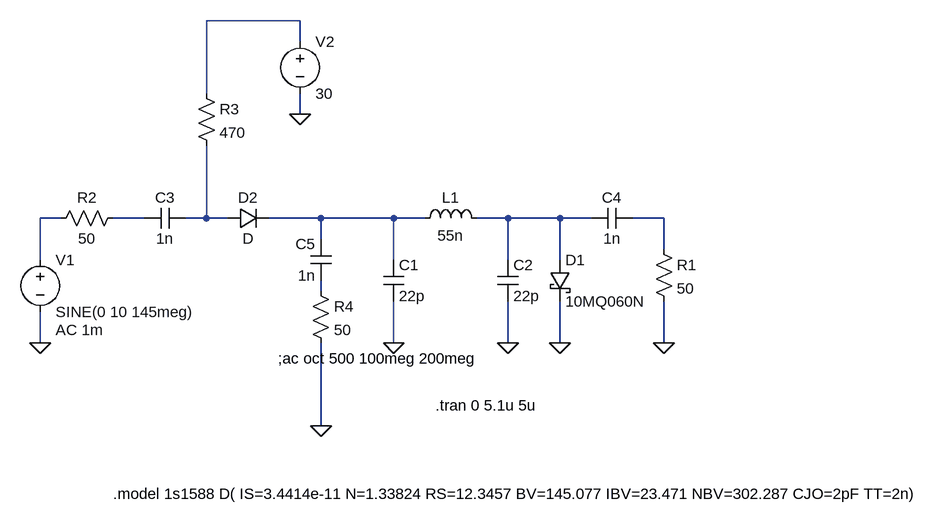
[diagram p0: schematic ANT SW.asc]
ANT SW.asc, the LTspice schematic file:
Version 4
SHEET 1 1196 680
WIRE 48 -224 -96 -224
WIRE 48 -192 48 -224
WIRE -96 -112 -96 -224
WIRE 48 -80 48 -112
WIRE -320 80 -352 80
WIRE -192 80 -240 80
WIRE -96 80 -96 -32
WIRE -96 80 -128 80
WIRE -64 80 -96 80
WIRE 80 80 0 80
WIRE 192 80 80 80
WIRE 240 80 192 80
WIRE 368 80 320 80
WIRE 448 80 368 80
WIRE 496 80 448 80
WIRE 608 80 560 80
WIRE 80 112 80 80
WIRE 608 128 608 80
WIRE -352 144 -352 80
WIRE 192 144 192 80
WIRE 368 144 368 80
WIRE 448 144 448 80
WIRE 80 192 80 176
WIRE -352 272 -352 224
WIRE 192 272 192 208
WIRE 368 272 368 208
WIRE 448 272 448 208
WIRE 608 272 608 208
WIRE 80 400 80 272
FLAG -352 272 0
FLAG 192 272 0
FLAG 368 272 0
FLAG 448 272 0
FLAG 608 272 0
FLAG 48 -80 0
FLAG 80 400 0
SYMBOL voltage -352 128 R0
WINDOW 123 24 124 Left 2
WINDOW 39 0 0 Left 2
SYMATTR InstName V1
SYMATTR Value SINE(0 10 145meg)
SYMATTR Value2 AC 1m
SYMBOL cap 176 144 R0
SYMATTR InstName C1
SYMATTR Value 22p
SYMBOL cap 352 144 R0
SYMATTR InstName C2
SYMATTR Value 22p
SYMBOL schottky 432 144 R0
SYMATTR InstName D1
SYMATTR Value 10MQ060N
SYMATTR Description Diode
SYMATTR Type diode
SYMBOL res 592 112 R0
SYMATTR InstName R1
SYMATTR Value 50
SYMBOL res -224 64 R90
WINDOW 0 0 56 VBottom 2
WINDOW 3 32 56 VTop 2
SYMATTR InstName R2
SYMATTR Value 50
SYMBOL ind 224 96 R270
WINDOW 0 32 56 VTop 2
WINDOW 3 5 56 VBottom 2
SYMATTR InstName L1
SYMATTR Value 55n
SYMBOL cap -128 64 R90
WINDOW 0 0 32 VBottom 2
WINDOW 3 32 32 VTop 2
SYMATTR InstName C3
SYMATTR Value 1n
SYMBOL voltage 48 -208 R0
WINDOW 123 0 0 Left 2
WINDOW 39 0 0 Left 2
SYMATTR InstName V2
SYMATTR Value 30
SYMBOL res -112 -128 R0
SYMATTR InstName R3
SYMATTR Value 470
SYMBOL res 64 176 R0
SYMATTR InstName R4
SYMATTR Value 50
SYMBOL cap 560 64 R90
WINDOW 0 0 32 VBottom 2
WINDOW 3 32 32 VTop 2
SYMATTR InstName C4
SYMATTR Value 1n
SYMBOL cap 96 176 R180
WINDOW 0 24 56 Left 2
WINDOW 3 24 8 Left 2
SYMATTR InstName C5
SYMATTR Value 1n
SYMBOL diode -64 64 M90
WINDOW 0 0 32 VBottom 2
WINDOW 3 32 32 VTop 2
SYMATTR InstName D2
TEXT 14 296 Left 2 !;ac oct 500 100meg 200meg
TEXT 256 368 Left 2 !.tran 0 5.1u 5u
TEXT -240 504 Left 2 !.model 1s1588 D( IS=3.4414e-11 N=1.33824 RS=12.3457 BV=145.077 IBV=23.471 NBV=302.287 CJO=2pF TT=2n)

The netlist it stands for:
* ANT SW.asc
V1 N002 0 SINE(0 10 145meg) AC 1m
C1 N005 0 22p
C2 N006 0 22p
D1 N006 0 10MQ060N
R1 N007 0 50
R2 N003 N002 50
L1 N005 N006 55n
C3 N004 N003 1n
V2 N001 0 30
R3 N001 N004 470
R4 N008 0 50
C4 N007 N006 1n
C5 N008 N005 1n
D2 N004 N005 D
.model D D
.lib standard.dio
;ac oct 500 100meg 200meg
.tran 0 5.1u 5u
.model 1s1588 D( IS=3.4414e-11 N=1.33824 RS=12.3457 BV=145.077 IBV=23.471 NBV=302.287 CJO=2pF TT=2n)
.backanno
.end